# Altium schematic sheet Sheet1.SchDoc
size A
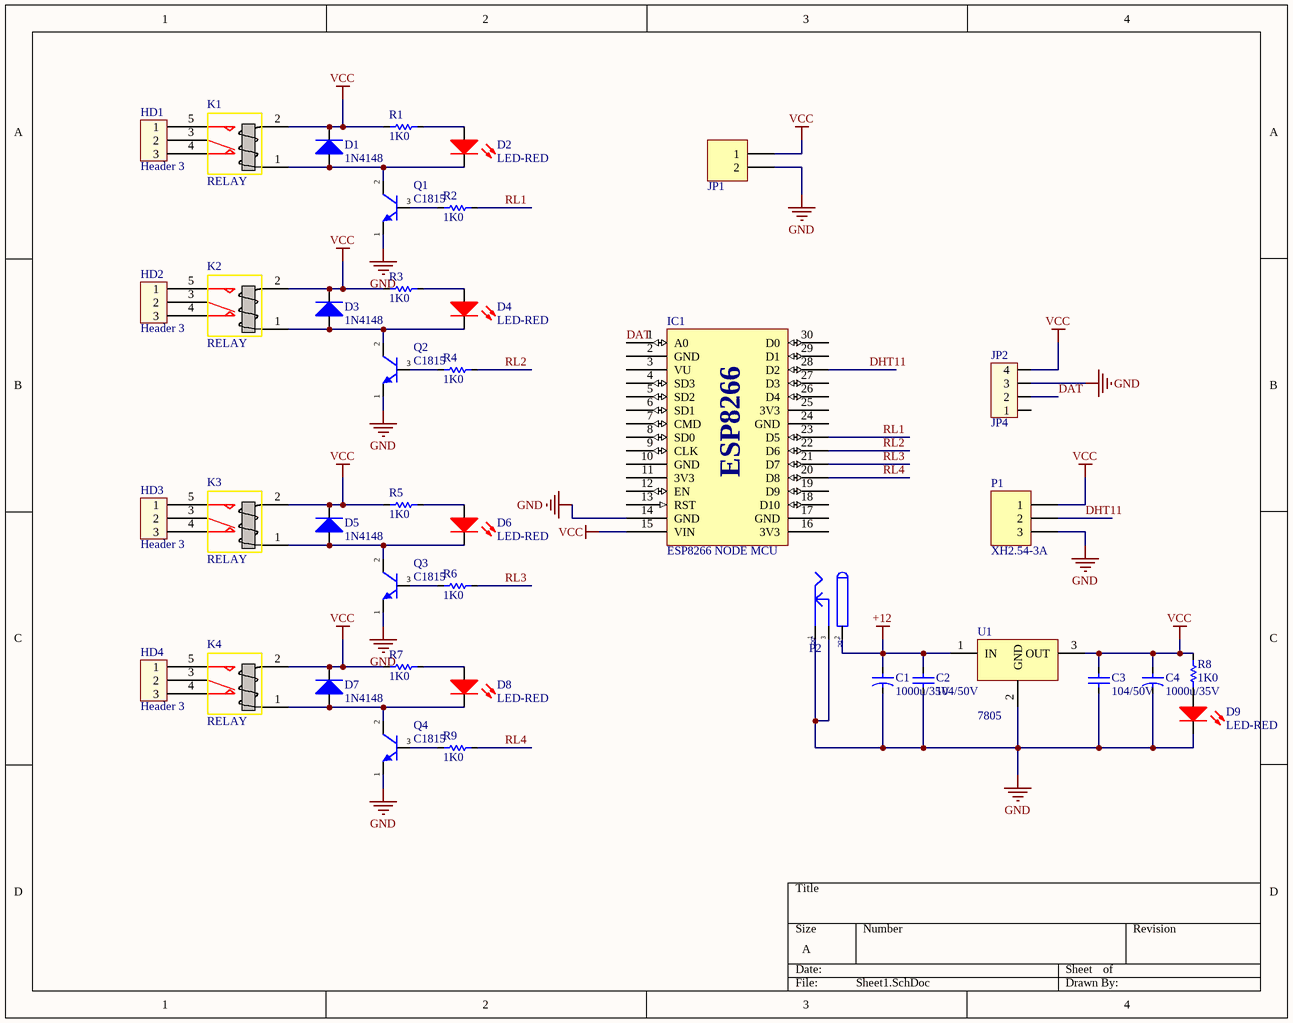
[diagram p0: Sheet1.SchDoc]

## Parts
C1  1000u/35V  [CAP 13x25x5]
C2  104/50V  [CAP_NP_100]
C3  104/50V  [CAP_NP_100]
C4  1000u/35V  [CAP 13x25x5]
D1  1N4148  [DO35-GLASS-300MIL]
D2  LED-RED  [LED-3mm]
D3  1N4148  [DO35-GLASS-300MIL]
D4  LED-RED  [LED-3mm]
D5  1N4148  [DO35-GLASS-300MIL]
D6  LED-RED  [LED-3mm]
D7  1N4148  [DO35-GLASS-300MIL]
D8  LED-RED  [LED-3mm]
D9  LED-RED  [LED-3mm]
HD1  Header 3  [HED3]
HD2  Header 3  [HED3]
HD3  Header 3  [HED3]
HD4  Header 3  [HED3]
IC1  ESP8266 NODE MCU  [ESP8266 NodeMCU]
JP1  Header 2_1  [HED2]  (value not drawn)
JP2  JP4  [CON4]
K1  RELAY  [RELAY 12V_112D1]
K2  RELAY  [RELAY 12V_112D1]
K3  RELAY  [RELAY 12V_112D1]
K4  RELAY  [RELAY 12V_112D1]
P1  XH2.54-3A  [XH2.54-3A]
P2  DC005  [JACK DC 5.5x2]  (value not drawn)
Q1  C1815  [TO-92]
Q2  C1815  [TO-92]
Q3  C1815  [TO-92]
Q4  C1815  [TO-92]
R1  1K0  [R-300mil]
R2  1K0  [R-300mil]
R3  1K0  [R-300mil]
R4  1K0  [R-300mil]
R5  1K0  [R-300mil]
R6  1K0  [R-300mil]
R7  1K0  [R-300mil]
R8  1K0  [R-300mil]
R9  1K0  [R-300mil]
U1  7805  [TO 220+TN]

## Nets
+12: C1.1 C2.1 P2.2 U1.1(IN)
GND: C1.2 C2.2 C3.2 C4.2 D9.2(K) IC1.14(GND) JP1.2 JP2.3 P1.3 P2.1 P2.3 Q1.1(E) Q2.1(E) Q3.1(E) Q4.1(E) U1.2(GND)
VCC: C3.1 C4.1 D1.2(K) D3.2(K) D5.2(K) D7.2(K) IC1.15(VIN) JP1.1 JP2.4 K1.2(Coil2) K2.2(Coil2) K3.2(Coil2) K4.2(Coil2) P1.1 R1.2 R3.2 R5.2 R7.2 R8.1 U1.3(OUT)
DAT: IC1.1(A0) JP2.2
DHT11: IC1.28(D2) P1.2
RL1: IC1.23(D5) R2.1
RL2: IC1.22(D6) R4.1
RL3: IC1.21(D7) R6.1
RL4: IC1.20(D8) R9.1
NetD1_1: D1.1(A) D2.2(K) K1.1(Coil1) Q1.2(C)
NetD2_1: D2.1(A) R1.1
NetD3_1: D3.1(A) D4.2(K) K2.1(Coil1) Q2.2(C)
NetD4_1: D4.1(A) R3.1
NetD5_1: D5.1(A) D6.2(K) K3.1(Coil1) Q3.2(C)
NetD6_1: D6.1(A) R5.1
NetD7_1: D7.1(A) D8.2(K) K4.1(Coil1) Q4.2(C)
NetD8_1: D8.1(A) R7.1
NetD9_1: D9.1(A) R8.2
NetHD1_1: HD1.1 K1.5(NC)
NetHD1_2: HD1.2 K1.3(COM)
NetHD1_3: HD1.3 K1.4(NO)
NetHD2_1: HD2.1 K2.5(NC)
NetHD2_2: HD2.2 K2.3(COM)
NetHD2_3: HD2.3 K2.4(NO)
NetHD3_1: HD3.1 K3.5(NC)
NetHD3_2: HD3.2 K3.3(COM)
NetHD3_3: HD3.3 K3.4(NO)
NetHD4_1: HD4.1 K4.5(NC)
NetHD4_2: HD4.2 K4.3(COM)
NetHD4_3: HD4.3 K4.4(NO)
NetQ1_3: Q1.3(B) R2.2
NetQ2_3: Q2.3(B) R4.2
NetQ3_3: Q3.3(B) R6.2
NetQ4_3: Q4.3(B) R9.2

Not connected (* = marked no-connect by the designer): IC1 2(GND) 3(VU) 4(SD3) 5(SD2) 6(SD1) 7(CMD) 8(SD0) 9(CLK) 10(GND) 11(3V3) 12(EN) 13(RST) 16(3V3) 17(GND) 18(D10) 19(D9) 24(GND) 25(3V3) 26(D4) 27(D3) 29(D1) 30(D0); JP2 1

## Notes on the sheet
- (in symbol ESP8266 NodeMCU) ESP8266
- (in symbol JACK DC5.5x2.1) -DC; +DC

## Library data of the parts
C1 C4 = 1000u/35V (13x25x5): 1000uF 35V Through Hole Aluminum Electrolytic Capacitor; Mounting_Type: Through_Hole; Value: 1000uF/35V; Parameter 2: *; Parameter 3: *
C2 C3 = CER-104-50V: SAPO_CODE: 510470; SAPO_NAME: Tụ Ceramic 104 (Túi 10c); Mounting_Type: Through_Hole; Price: 100; Processing Cost: *; Value: *
D1 D3 D5 D7 = 1N4148 DO35: 0.2A 75V Diode Standard Through Hole DO-35; Mounting_Type: Through_Hole; SAPO_CODE: 260140; SAPO_NAME: 1N4148 0.3A100V DIP(DO-35); Value: 1N4148 DO-35; Price: 200; Processing Cost: *
D2 D4 D6 D8 D9 = LED-3MM-RED-LENS_RED: Mounting_Type: Through_Hole; SAPO_NAME: LED 3mm Đỏ (Có màu); SAPO_CODE: 140160; Value: LED-RED 3mm; Price: *; Processing Cost: *
HD1-HD4 = Hed3: Header 3 (Green); Value: Header 3
IC1 = ESP8266 NodeMCU: LUA-ESP8266 Wifi Module Techmt.vn
JP1 = Header 2_1: Header, 2-Pin; Manufacturer: Generic Components; Class: Connector; Value: Header 2
JP2 = Con4: Connector 4; Value: Connector 4
K1-K4 = RELAY 4
P1 = XH2.54-3A: Mounting_Type: Through_Hole; SAPO_CODE: 201170; SAPO_NAME: XH2.54-3A Đực 3 chân thẳng; Value: XH2.54-3A; Price: 250; ComponentLink1Description: linhkienviet; ComponentLink1URL: http://linhkienviet.vn/xh2-54-3a-duc-3-chan-thang
P2 = JACK DC5.5x2.1: Jack DC 5.5x2.1; SAPO_NAME: Chân nguồn DC cái 5.5x2.1mm (DC005); SAPO_CODE: 200140; Mounting_Type: Through_Hole; Price: 1000; Processing Cost: *
Q1-Q4 = C1815-TO92: TRANS NPN 50V 0.15A TO-92; SAPO_CODE: 490220; SAPO_NAME: C1815 TO-92; Mounting_Type: Through_Hole; Value: C1815 TO-92; Price: 350; Processing Cost: *; ComponentLink1Description: linhkienviet; ComponentLink1URL: http://linhkienviet.vn/c1815-to-92
R1-R9 = R-1/4W-5%-1K0: RES 1K OHM 1/4W 5% CARBON FILM; Mounting_Type: Through_Hole; SAPO_CODE: 255700; SAPO_NAME: Resistor 1/4W 5% 1K0; Value: 1K 1/4W; Price: 40; Processing Cost: *
U1 = 7805 TO-220: Linear Voltage Regulator IC Positive Fixed 1 Output 5V 1A TO-220AB; Mounting_Type: Through_Hole; SAPO_NAME: L7805CV 5V 1.5A TO220; SAPO_CODE: 320700; Value: *